# Altium schematic sheet transc_MIWI868.SchDoc
size A
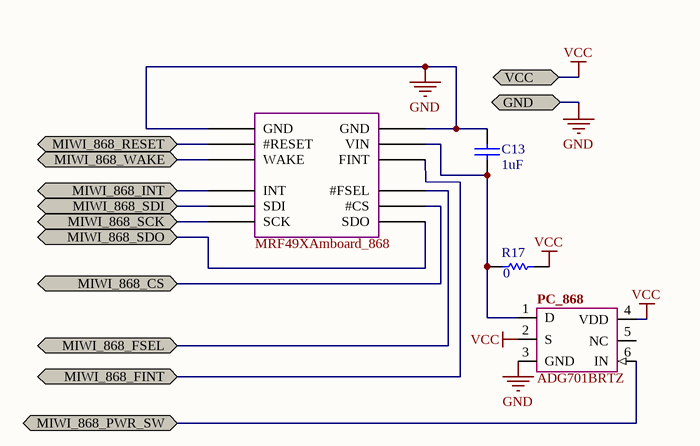
[diagram p0: transc_MIWI868.SchDoc]

## Parts
C13  value 1uF  [1608[0603]]  (hidden comment: Cap)
MRF49XAmboard_868  MRF49XAmboard  [MRF49XAmboard]  (value not drawn)
PC_868  ADG701BRTZ  [SOT23-6_L]
R17  value 0  [1608[0603]]  (hidden comment: resistor)

## Ports
GND, MIWI_868_CS, MIWI_868_FINT, MIWI_868_FSEL, MIWI_868_INT, MIWI_868_PWR_SW, MIWI_868_RESET, MIWI_868_SCK, MIWI_868_SDI, MIWI_868_SDO, MIWI_868_WAKE, VCC

## Nets
GND: C13.1 MRF49XAmboard_868.1(GND) MRF49XAmboard_868.12(GND) PC_868.3(GND) ; port GND
VCC: PC_868.2(S) PC_868.4(VDD) R17.1 ; port VCC
MIWI_868_CS: MRF49XAmboard_868.8(#CS) ; port MIWI_868_CS
MIWI_868_FINT: MRF49XAmboard_868.10(FINT) ; port MIWI_868_FINT
MIWI_868_FSEL: MRF49XAmboard_868.9(#FSEL) ; port MIWI_868_FSEL
MIWI_868_INT: MRF49XAmboard_868.4(INT) ; port MIWI_868_INT
MIWI_868_PWR_SW: PC_868.6(IN) ; port MIWI_868_PWR_SW
MIWI_868_RESET: MRF49XAmboard_868.2(#RESET) ; port MIWI_868_RESET
MIWI_868_SCK: MRF49XAmboard_868.6(SCK) ; port MIWI_868_SCK
MIWI_868_SDI: MRF49XAmboard_868.5(SDI) ; port MIWI_868_SDI
MIWI_868_SDO: MRF49XAmboard_868.7(SDO) ; port MIWI_868_SDO
MIWI_868_WAKE: MRF49XAmboard_868.3(WAKE) ; port MIWI_868_WAKE
NetC13_2: C13.2 MRF49XAmboard_868.11(VIN) PC_868.1(D) R17.2

Not connected (* = marked no-connect by the designer): PC_868 5(NC)

## Library data of the parts
C13 = Cap: Capacitor; Published: 8-Jun-2000; LatestRevisionDate: 17-Jul-2002; LatestRevisionNote: Re-released for DXP Platform.; PackageReference: RAD-0.3; Publisher: Altium Limited; PackageDescription: Radial Cap, Thru-Hole; 2 Leads; 0.3 in Pin Spacing
MRF49XAmboard_868 = MRF49XAmboard: Microchip RF radio; buy: farnell:1630202
R17 = RES: Published: 8-Jun-2000; LatestRevisionDate: 17-Jul-2002; LatestRevisionNote: Re-released for DXP Platform.; PackageReference: AXIAL-0.3; Publisher: Altium Limited; PackageDescription: Axial Device, Thru-Hole; 2 Leads; 0.3 in Pin Spacing